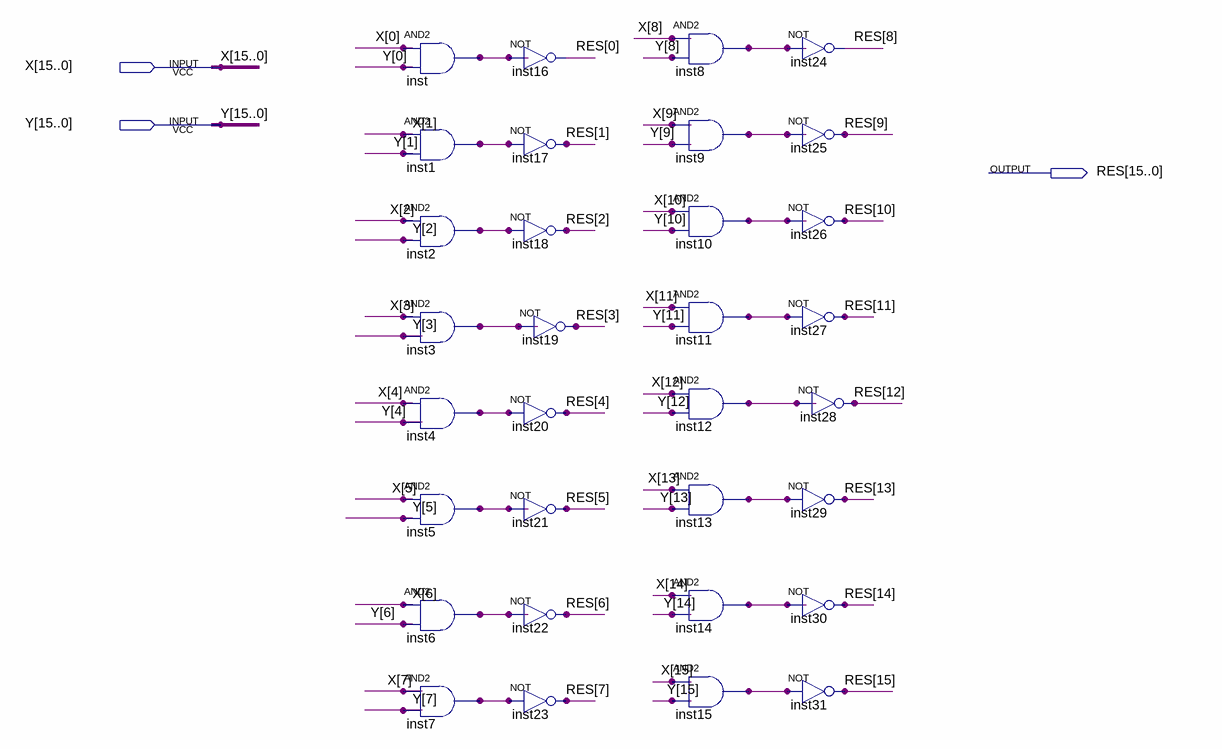
[diagram p0: schematic sheet]
// Quartus schematic nand.bdf as structural Verilog: 32 symbols, 3 pins
module \nand  (
  input  [15:0] X,
  input  [15:0] Y,
  output [15:0] RES
);

  wire inst1_out, inst2_out, inst3_out, inst4_out, inst5_out, inst6_out, inst7_out, inst8_out, inst9_out,
       inst10_out, inst11_out, inst12_out, inst13_out, inst14_out, inst15_out, inst_out;

  and inst (inst_out, X[0], Y[0]);
  and inst1 (inst1_out, X[1], Y[1]);
  and inst2 (inst2_out, X[2], Y[2]);
  and inst3 (inst3_out, X[3], Y[3]);
  and inst4 (inst4_out, X[4], Y[4]);
  and inst5 (inst5_out, X[5], Y[5]);
  and inst6 (inst6_out, X[6], Y[6]);
  and inst7 (inst7_out, X[7], Y[7]);
  not inst16 (RES[0], inst_out);
  not inst17 (RES[1], inst1_out);
  not inst18 (RES[2], inst2_out);
  not inst19 (RES[3], inst3_out);
  not inst20 (RES[4], inst4_out);
  not inst21 (RES[5], inst5_out);
  not inst22 (RES[6], inst6_out);
  not inst23 (RES[7], inst7_out);
  and inst8 (inst8_out, X[8], Y[8]);
  and inst9 (inst9_out, X[9], Y[9]);
  and inst10 (inst10_out, X[10], Y[10]);
  and inst11 (inst11_out, X[11], Y[11]);
  and inst12 (inst12_out, X[12], Y[12]);
  and inst13 (inst13_out, X[13], Y[13]);
  and inst14 (inst14_out, X[14], Y[14]);
  and inst15 (inst15_out, X[15], Y[15]);
  not inst24 (RES[8], inst8_out);
  not inst25 (RES[9], inst9_out);
  not inst26 (RES[10], inst10_out);
  not inst27 (RES[11], inst11_out);
  not inst28 (RES[12], inst12_out);
  not inst29 (RES[13], inst13_out);
  not inst30 (RES[14], inst14_out);
  not inst31 (RES[15], inst15_out);
endmodule
